# Altium schematic sheet power.SchDoc: Magic Baton: Power
size Letter
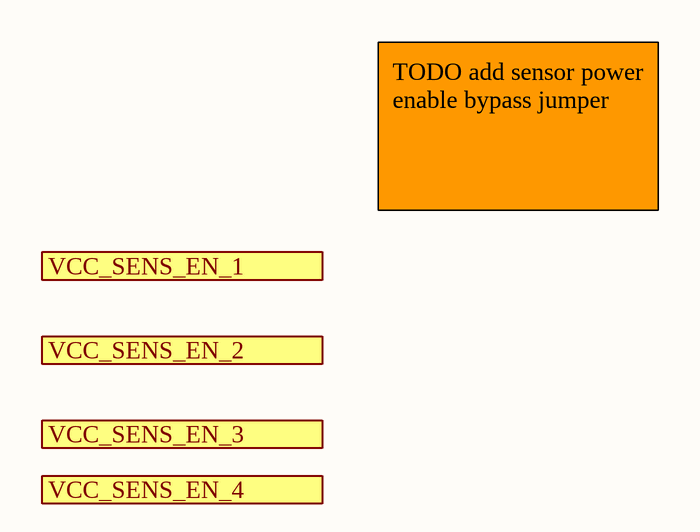
[diagram p0: power.SchDoc]

## Ports
VCC_SENS_EN_1 (in), VCC_SENS_EN_2 (in), VCC_SENS_EN_3 (in), VCC_SENS_EN_4 (in)

## Notes on the sheet
- TODO add sensor power enable bypass jumper
- Title
- Size:
- Date:
- Letter
- Number:
- Time:
- Revision:
- Sheet
- of
- File: